# EAGLE design connectionring (EAGLE 5.06)
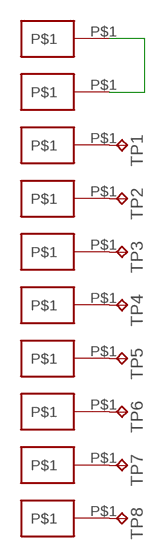
[diagram p0: schematic, sheet 1]

## Parts
TP1  TPB1,27  [B1,27]
TP2  TPB1,27  [B1,27]
TP3  TPB1,27  [B1,27]
TP4  TPB1,27  [B1,27]
TP5  TPB1,27  [B1,27]
TP6  TPB1,27  [B1,27]
TP7  TPB1,27  [B1,27]
TP8  TPB1,27  [B1,27]
U$1  900-SPRING-PIN  [0900]
U$2  900-SPRING-PIN  [0900]
U$3  900-SPRING-PIN  [0900]
U$4  900-SPRING-PIN  [0900]
U$5  900-SPRING-PIN  [0900]
U$6  900-SPRING-PIN  [0900]
U$7  900-SPRING-PIN  [0900]
U$8  900-SPRING-PIN  [0900]
U$9  900-SPRING-PIN  [0900]
U$10  900-SPRING-PIN  [0900]

## Nets
N$1: U$9.P$1 U$10.P$1
N$2: TP2.PP(TP) U$7.P$1
N$3: TP1.PP(TP) U$8.P$1
N$4: TP3.PP(TP) U$6.P$1
N$5: TP4.PP(TP) U$5.P$1
N$6: TP5.PP(TP) U$4.P$1
N$7: TP6.PP(TP) U$3.P$1
N$8: TP7.PP(TP) U$2.P$1
N$9: TP8.PP(TP) U$1.P$1

## Library data of the parts
TP1-TP8 = testpad:TP: Test pad
U$1-U$10 = pogopins:900-SPRING-PIN

## Board
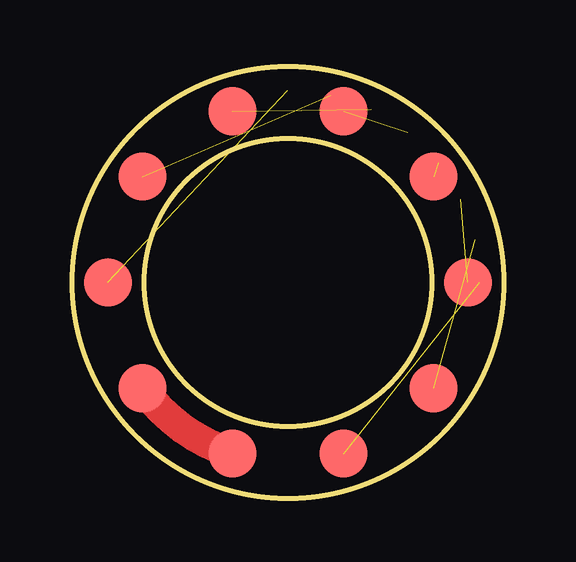
[diagram p1: board, top side]
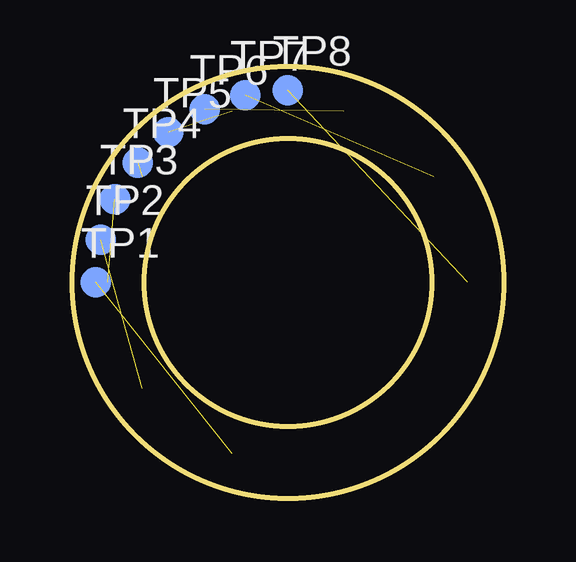
[diagram p2: board, bottom side, seen from below]

Size 18 x 18 mm. Coordinates in mm from the lower left corner, seen from the top.
Outline: circle at 9,9 radius 6
Outline: circle at 9,9 radius 9
Copper layers (1*16): Top 0.035mm / dielectric 1.5mm / Bottom 0.035mm
Design rules "default *": minimum track width 10mil, minimum drill 24mil, track to track 8mil, track to pad 8mil, pad to pad 8mil, via to via 8mil, smd to smd 8mil, copper to edge 20mil, drill to drill 8mil, minimum pad ring 10mil, minimum via ring 8mil, stop-mask expansion 4mil, vias tented up to drill 0mil, thermal gap 10mil

### Footprints (pad centres in the part's own frame; a part is rotated, then mirrored left to right if it is on the bottom)
B1,27 = smd 1.27 x 1.27: PP 0,0
0900 = smd 2 x 2: P$1 0,0

### Placement (x,y rotation side)
TP1  17,9 0 bottom
TP2  16.8,10.78 0 bottom
TP3  16.21,12.47 0 bottom
TP4  15.25,13.99 0 bottom
TP5  13.99,15.25 0 bottom
TP6  12.47,16.21 0 bottom
TP7  10.78,16.8 0 bottom
TP8  9,17 0 bottom
U$1  1.5,9 108 top
U$2  2.93,13.41 108 top
U$3  6.68,16.13 108 top
U$4  11.32,16.13 108 top
U$5  15.07,13.41 108 top
U$6  16.5,9 108 top
U$7  15.07,4.59 108 top
U$8  11.32,1.87 108 top
U$9  6.68,1.87 108 top
U$10  2.93,4.59 108 top

### Tracks (layer width: path | path; a pad name or v marks a point on that pad's centre or on a via)
N$1
  Top 1.27: U$9.P$1 arc-36 U$10.P$1
N$2  (1 unrouted)
N$3  (1 unrouted)
N$4  (1 unrouted)
N$5  (1 unrouted)
N$6  (1 unrouted)
N$7  (1 unrouted)
N$8  (1 unrouted)
N$9  (1 unrouted)